# EAGLE design adalogger_shield_v1 (EAGLE 8.5.2)
ESP Devkit-C Shield
CNAME: Adafruit M0 Adalogger NB-IoT Shield Design; CREVISION: 1.0; DESIGNER: EREN MERT IREZ; UNTITLED: Shield Schematic
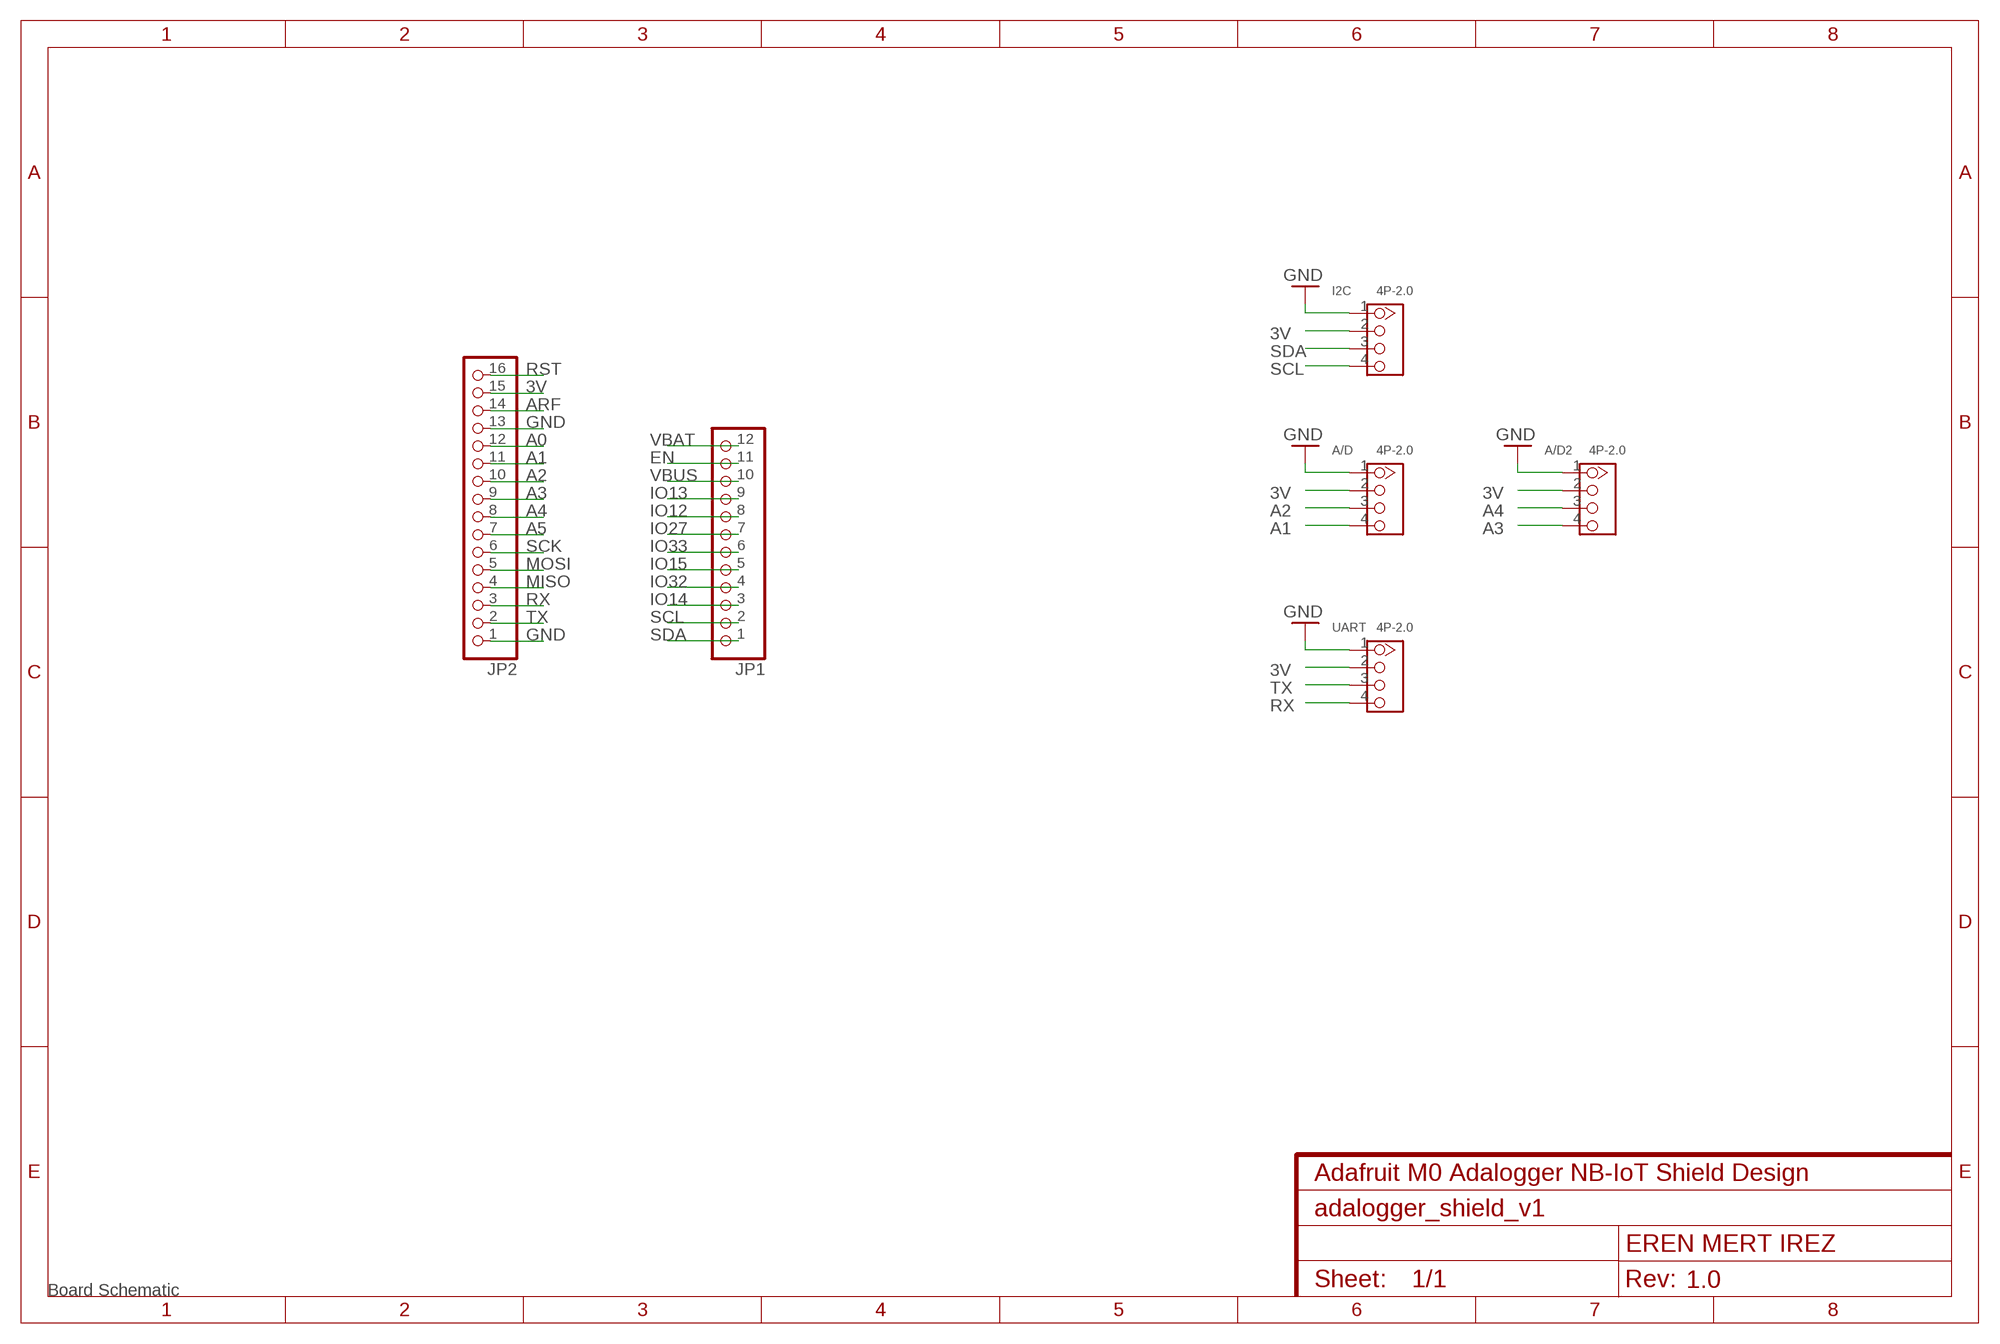
[diagram p0: schematic, sheet 1]
FRAME1 (FRAME-A4L): UNTITLED: Board Schematic

## Parts
A/D  4P-2.0  GROVE-CONNECTOR-DIP(4P-2.0)  [HW4-2.0]
A/D2  4P-2.0  GROVE-CONNECTOR-DIP(4P-2.0)  [HW4-2.0]
I2C  4P-2.0  GROVE-CONNECTOR-DIP(4P-2.0)  [HW4-2.0]
JP1  HEADER-1X12  [1X12_ROUND]
JP2  HEADER-1X16ROUND  [1X16_ROUND]
UART  4P-2.0  GROVE-CONNECTOR-DIP(4P-2.0)  [HW4-2.0]

## Nets
3V: A/D2.2 A/D.2 I2C.2 JP2.15 UART.2
A0: JP2.12
A1: A/D.4 JP2.11
A2: A/D.3 JP2.10
A3: A/D2.4 JP2.9
A4: A/D2.3 JP2.8
A5: JP2.7
ARF: JP2.14
EN: JP1.11
GND: A/D2.1 A/D.1 I2C.1 JP2.1 JP2.13 UART.1
IO12: JP1.8
IO13: JP1.9
IO14: JP1.3
IO15: JP1.5
IO27: JP1.7
IO32: JP1.4
IO33: JP1.6
MISO: JP2.4
MOSI: JP2.5
RST: JP2.16
RX: JP2.3 UART.4
SCK: JP2.6
SCL: I2C.4 JP1.2
SDA: I2C.3 JP1.1
TX: JP2.2 UART.3
VBAT: JP1.12
VBUS: JP1.10

## Library data of the parts
A/D A/D2 I2C UART = Seeed-Connector -2016:GROVE-CONNECTOR-DIP(4P-2.0): 320110033
JP1 = microbuilder:HEADER-1X12
JP2 = microbuilder:HEADER-1X16: PIN HEADER

## Board
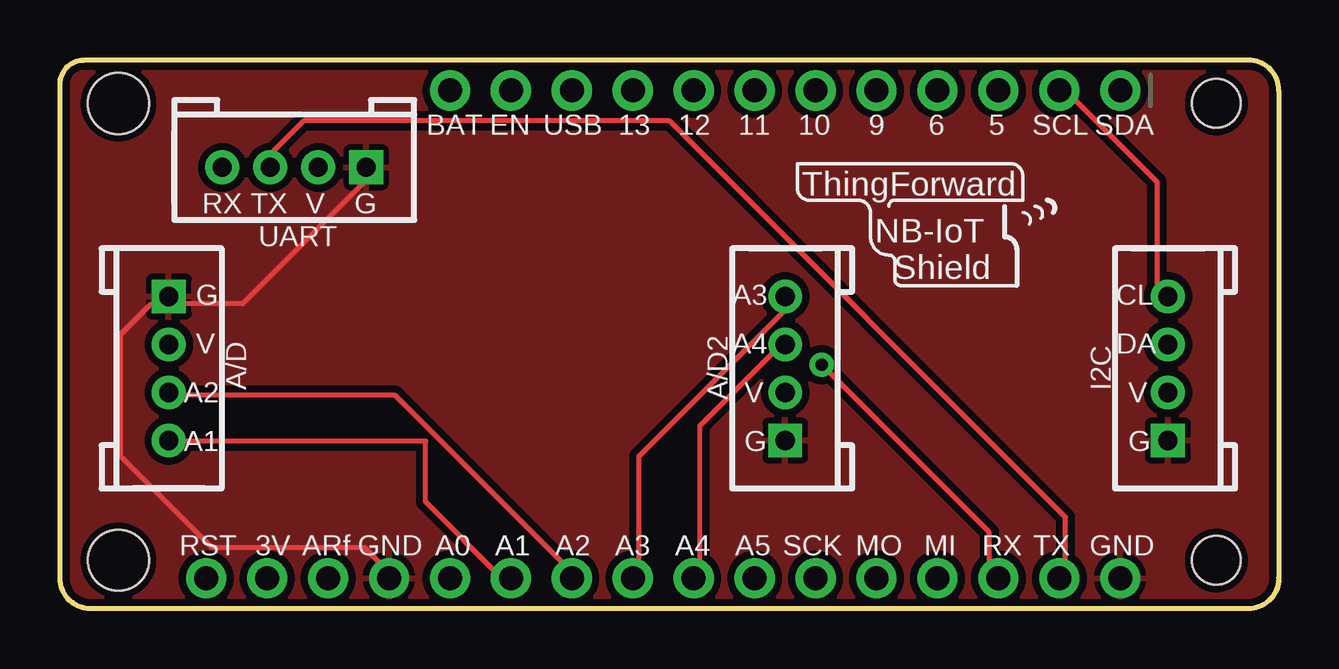
[diagram p1: board, top side]
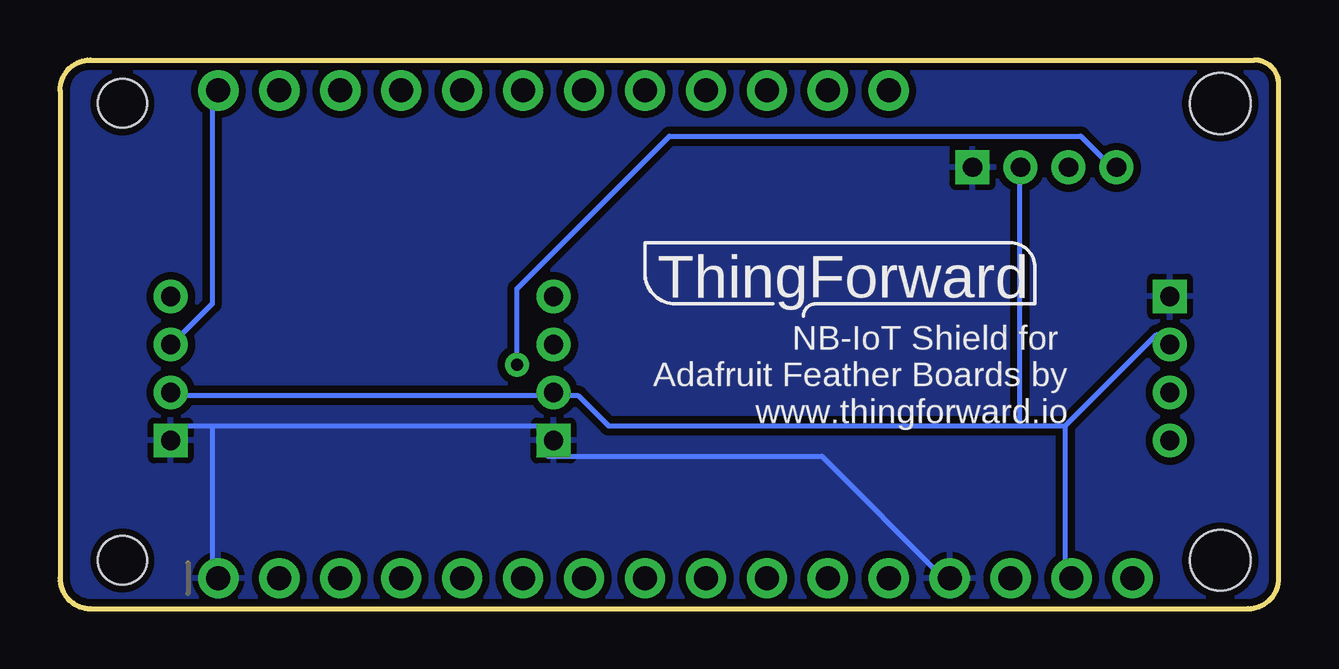
[diagram p2: board, bottom side, seen from below]

Size 50.8 x 22.86 mm. Coordinates in mm from the lower left corner, seen from the top.
Outline: 50.8,21.59 arc90 49.53,22.86 1.02,22.86 arc90 0,21.84 0,1.27 arc90 1.27,0 49.53,0 arc90 50.8,1.27 50.8,21.59
Copper layers (1*16): Top 0.035mm / dielectric 1.5mm / Bottom 0.035mm
Design rules "SparkFun": minimum track width 8mil, minimum drill 20mil, track to track 8mil, track to pad 8mil, pad to pad 8mil, via to via 8mil, smd to smd 8mil, copper to edge 8mil, drill to drill 8mil, minimum pad ring 12mil, minimum via ring 10mil, stop-mask expansion 4mil, vias tented up to drill 20mil, thermal gap 10mil
Holes 2.54 mm at 2.44,21.05 2.44,2.01
Holes 2.03 mm at 48.2,21.05 48.2,2.01

### Footprints (pad centres in the part's own frame; a part is rotated, then mirrored left to right if it is on the bottom)
HW4-2.0 = drill 0.8 pad 1.27 square: 1 -3,0 | drill 0.8 pad 1.27: 2 -1,0; 3 1,0; 4 3,0
1X12_ROUND = drill 1 pad 1.676: 1 -13.97,0; 2 -11.43,0; 3 -8.89,0; 4 -6.35,0; 5 -3.81,0; 6 -1.27,0; 7 1.27,0; 8 3.81,0; 9 6.35,0; 10 8.89,0; 11 11.43,0; 12 13.97,0
1X16_ROUND = drill 1 pad 1.676: 1 -19.05,0; 2 -16.51,0; 3 -13.97,0; 4 -11.43,0; 5 -8.89,0; 6 -6.35,0; 7 -3.81,0; 8 -1.27,0; 9 1.27,0; 10 3.81,0; 11 6.35,0; 12 8.89,0; 13 11.43,0; 14 13.97,0; 15 16.51,0; 16 19.05,0

### Placement (x,y rotation side)
A/D  4.54,10.01 270 top
A/D2  30.23,10.01 90 top
I2C  46.18,10.01 90 top
JP1  30.23,21.59 180 top
JP2  25.15,1.27 0 bottom
UART  9.76,18.39 180 top

### Tracks (layer width: path | path; a pad name or v marks a point on that pad's centre or on a via)
3V
  Bottom 0.203: 8.89,7.62 5.08,11.43 A/D.2 | 8.89,7.62 8.89,1.27 JP2.15 | 30.48,8.89 45.72,8.89 I2C.2 | 10.79,7.62 27.94,7.62 29.21,8.89 30.48,8.89 | 10.79,7.62 8.89,7.62 | 30.48,8.89 A/D2.2 | 10.79,7.62 10.79,17.78 UART.2
A1
  Top 0.203: A/D.4 5.08,6.98 15.24,6.98 15.24,4.45 18.41,1.27 JP2.11
A2
  Top 0.203: A/D.3 5.08,8.89 13.97,8.89 21.59,1.27 JP2.10
A3
  Top 0.203: A/D2.4 30.48,12.7 24.13,6.35 24.13,1.27 JP2.9
A4
  Top 0.203: A/D2.3 30.48,11.43 26.67,7.62 26.67,1.27 JP2.8
GND
  Top 0.203: 5.08,12.7 7.62,12.7 12.7,17.78 UART.1 | 5.08,12.7 3.81,12.7 2.54,11.43 2.54,6.35 6.35,2.54 12.7,2.54 13.97,1.27 JP2.13 | 5.08,12.7 A/D.1
  Bottom 0.203: 44.45,7.62 45.72,7.62 I2C.1 | 44.45,7.62 30.48,7.62 A/D2.1 30.48,6.35 19.05,6.35 13.97,1.27 JP2.13 | 44.45,7.62 44.45,1.27 JP2.1
  pour Top (isolate 0.305): 0,1.27 0,21.84 arc-90 1.02,22.86 49.53,22.86 arc-90 50.8,21.59 50.8,1.27 arc-90 49.53,0 1.27,0 arc-90
  pour Bottom (isolate 0.305): 0,1.27 0,21.84 arc-90 1.02,22.86 49.53,22.86 arc-90 50.8,21.59 50.8,1.27 arc-90 49.53,0 1.27,0 arc-90
RX  (via drill 0.51)
  Top 0.203: v31.75,10.16 38.73,3.17 38.73,1.27 JP2.3
  Bottom 0.203: v31.75,10.16 31.75,13.34 25.4,19.68 8.26,19.68 6.99,18.41 UART.4
SCL
  Top 0.203: I2C.4 45.72,12.7 45.72,17.78 41.91,21.59 JP1.2
SDA
  Bottom 0.203: I2C.3 45.72,11.43 44.45,12.7 44.45,21.59 JP1.1
TX
  Top 0.203: UART.3 8.89,19.05 10.16,20.32 25.4,20.32 41.91,3.81 41.91,1.27 JP2.2

### Text on the board
tPlace: BAT | EN | USB | 13 | 12 | 11 | 10 | 9 | 6 | 5 | SCL | SDA | RX | TX | V | G | ThingForward | UART | NB-IoT / Shield | G | A3 | CL | A/D2 | V | A/D | A4 | DA | A2 | V | I2C | V | A1 | G | G | RST | 3V | ARf | GND | A0 | A1 | A2 | A3 | A4 | A5 | SCK | MO | MI | RX | TX | GND
bPlace: ThingForward | NB-IoT Shield for / Adafruit Feather Boards by / www.thingforward.io